# EAGLE design cheapskate_display_2 (EAGLE 5.02)
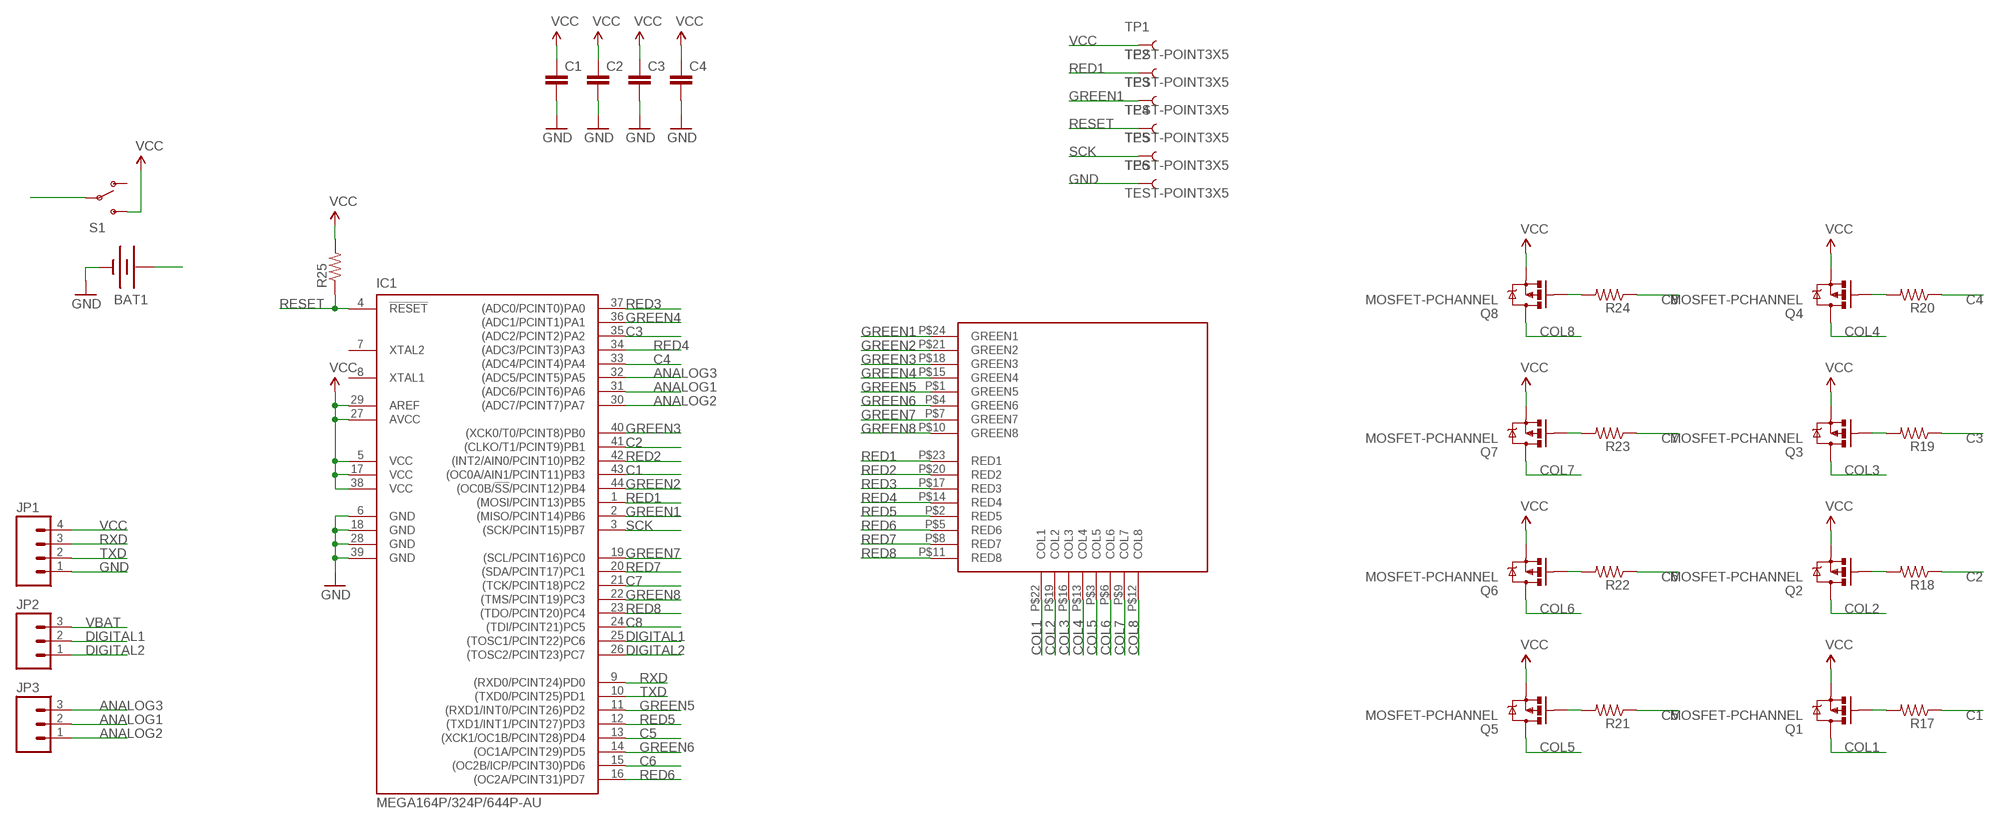
[diagram p0: schematic, sheet 1]

## Parts
BAT1  BATTERY  [MATTCON_20MM_PTH]
C1  CAP0603  [0603]
C2  CAP0603  [0603]
C3  CAP0603  [0603]
C4  CAP0603  [0603]
IC1  MEGA164P/324P/644P-AU  [TQFP44]
JP1  M04PTH  [1X04]
JP2  M03PTH  [1X03]
JP3  M03PTH  [1X03]
Q1  MOSFET-PCHANNEL  [SOT23]
Q2  MOSFET-PCHANNEL  [SOT23]
Q3  MOSFET-PCHANNEL  [SOT23]
Q4  MOSFET-PCHANNEL  [SOT23]
Q5  MOSFET-PCHANNEL  [SOT23]
Q6  MOSFET-PCHANNEL  [SOT23]
Q7  MOSFET-PCHANNEL  [SOT23]
Q8  MOSFET-PCHANNEL  [SOT23]
R17  RESISTOR0603  [0603]
R18  RESISTOR0603  [0603]
R19  RESISTOR0603  [0603]
R20  RESISTOR0603  [0603]
R21  RESISTOR0603  [0603]
R22  RESISTOR0603  [0603]
R23  RESISTOR0603  [0603]
R24  RESISTOR0603  [0603]
R25  RESISTOR0603  [0603]
S1  SWITCH-SPSTSMD2  [SWITCH-SPDT-SMD]
TP1  TEST-POINT3X5  [PAD.03X.05]
TP2  TEST-POINT3X5  [PAD.03X.05]
TP3  TEST-POINT3X5  [PAD.03X.05]
TP4  TEST-POINT3X5  [PAD.03X.05]
TP5  TEST-POINT3X5  [PAD.03X.05]
TP6  TEST-POINT3X5  [PAD.03X.05]
U$1  FYM-1228AXX  [FYM-12881ABXX]

## Nets
ANALOG1: IC1.31((ADC6/PCINT6)PA6) JP3.2
ANALOG2: IC1.30((ADC7/PCINT7)PA7) JP3.1
ANALOG3: IC1.32((ADC5/PCINT5)PA5) JP3.3
C1: IC1.43((OC0A/AIN1/PCINT11)PB3) R17.1
C2: IC1.41((CLKO/T1/PCINT9)PB1) R18.1
C3: IC1.35((ADC2/PCINT2)PA2) R19.1
C4: IC1.33((ADC4/PCINT4)PA4) R20.1
C5: IC1.13((XCK1/OC1B/PCINT28)PD4) R21.1
C6: IC1.15((OC2B/ICP/PCINT30)PD6) R22.1
C7: IC1.21((TCK/PCINT18)PC2) R23.1
C8: IC1.24((TDI/PCINT21)PC5) R24.1
COL1: Q1.3(D) U$1.P$22(COL1)
COL2: Q2.3(D) U$1.P$19(COL2)
COL3: Q3.3(D) U$1.P$16(COL3)
COL4: Q4.3(D) U$1.P$13(COL4)
COL5: Q5.3(D) U$1.P$3(COL5)
COL6: Q6.3(D) U$1.P$6(COL6)
COL7: Q7.3(D) U$1.P$9(COL7)
COL8: Q8.3(D) U$1.P$12(COL8)
DIGITAL1: IC1.25((TOSC1/PCINT22)PC6) JP2.2
DIGITAL2: IC1.26((TOSC2/PCINT23)PC7) JP2.1
GND: BAT1.3(-) C1.2 C2.2 C3.2 C4.2 IC1.6(GND) IC1.18(GND) IC1.28(GND) IC1.39(GND) JP1.1 TP6.P$1
GREEN1: IC1.2((MISO/PCINT14)PB6) TP3.P$1 U$1.P$24(GREEN1)
GREEN2: IC1.44((OC0B/!SS!/PCINT12)PB4) U$1.P$21(GREEN2)
GREEN3: IC1.40((XCK0/T0/PCINT8)PB0) U$1.P$18(GREEN3)
GREEN4: IC1.36((ADC1/PCINT1)PA1) U$1.P$15(GREEN4)
GREEN5: IC1.11((RXD1/INT0/PCINT26)PD2) U$1.P$1(GREEN5)
GREEN6: IC1.14((OC1A/PCINT29)PD5) U$1.P$4(GREEN6)
GREEN7: IC1.19((SCL/PCINT16)PC0) U$1.P$7(GREEN7)
GREEN8: IC1.22((TMS/PCINT19)PC3) U$1.P$10(GREEN8)
N$1: Q1.1(G) R17.2
N$3: Q2.1(G) R18.2
N$5: Q3.1(G) R19.2
N$7: Q4.1(G) R20.2
N$9: Q5.1(G) R21.2
N$11: Q6.1(G) R22.2
N$13: Q7.1(G) R23.2
N$15: Q8.1(G) R24.2
RED1: IC1.1((MOSI/PCINT13)PB5) TP2.P$1 U$1.P$23(RED1)
RED2: IC1.42((INT2/AIN0/PCINT10)PB2) U$1.P$20(RED2)
RED3: IC1.37((ADC0/PCINT0)PA0) U$1.P$17(RED3)
RED4: IC1.34((ADC3/PCINT3)PA3) U$1.P$14(RED4)
RED5: IC1.12((TXD1/INT1/PCINT27)PD3) U$1.P$2(RED5)
RED6: IC1.16((OC2A/PCINT31)PD7) U$1.P$5(RED6)
RED7: IC1.20((SDA/PCINT17)PC1) U$1.P$8(RED7)
RED8: IC1.23((TDO/PCINT20)PC4) U$1.P$11(RED8)
RESET: IC1.4(!RESET) R25.1 TP4.P$1
RXD: IC1.9((RXD0/PCINT24)PD0) JP1.3
SCK: IC1.3((SCK/PCINT15)PB7) TP5.P$1
TXD: IC1.10((TXD0/PCINT25)PD1) JP1.2
VBAT: BAT1.2(+) JP2.3 S1.2(P)
VCC: C1.1 C2.1 C3.1 C4.1 IC1.5(VCC) IC1.17(VCC) IC1.27(AVCC) IC1.29(AREF) IC1.38(VCC) JP1.4 Q1.2(S) Q2.2(S) Q3.2(S) Q4.2(S) Q5.2(S) Q6.2(S) Q7.2(S) Q8.2(S) R25.2 S1.3(S) TP1.P$1
Unconnected: IC1.7(XTAL2) IC1.8(XTAL1) S1.1(O)

## Library data of the parts
BAT1 = john:BATTERY: Battery Holders Various common sizes : AA, AAA, 20mm coin cell and 12mm coin cell.
C1-C4 = SparkFun:CAP: Capacitor Standard 0603 ceramic capacitor, and 0.1" leaded capacitor.
IC1 = avr-5:MEGA164P/324P/644P-AU
JP1 = SparkFun:M04: Header 4 Standard 4-pin 0.1" header. Use with straight break away headers (SKU : PRT-00116), right angle break away headers (PRT-00553), swiss pins (PRT-00743), machine pins (PRT-00117), and female headers (PRT-00115). Molex polarized connector foot print use with SKU : PRT-08231 with associated crimp pins and housings.
JP2 JP3 = SparkFun:M03: Header 3 Standard 3-pin 0.1" header. Use with straight break away headers (SKU : PRT-00116), right angle break away headers (PRT-00553), swiss pins (PRT-00743), machine pins (PRT-00117), and female headers (PRT-00115). Molex polarized connector foot print use with SKU : PRT-08232 with associated crimp pins and housings.
Q1-Q8 = SparkFun:MOSFET-PCHANNEL
R17-R25 = SparkFun:RESISTOR: Resistor Basic schematic elements and footprints for 0603, 1206, and PTH 1/10th watt (small) resistors.
S1 = SparkFun:SWITCH-SPST: SPST Switch Simple slide switch. Spark Fun Electronics SKU : COM-00102
TP1-TP6 = SparkFun:TEST-POINT
U$1 = john:FYM-1228AXX

## Board
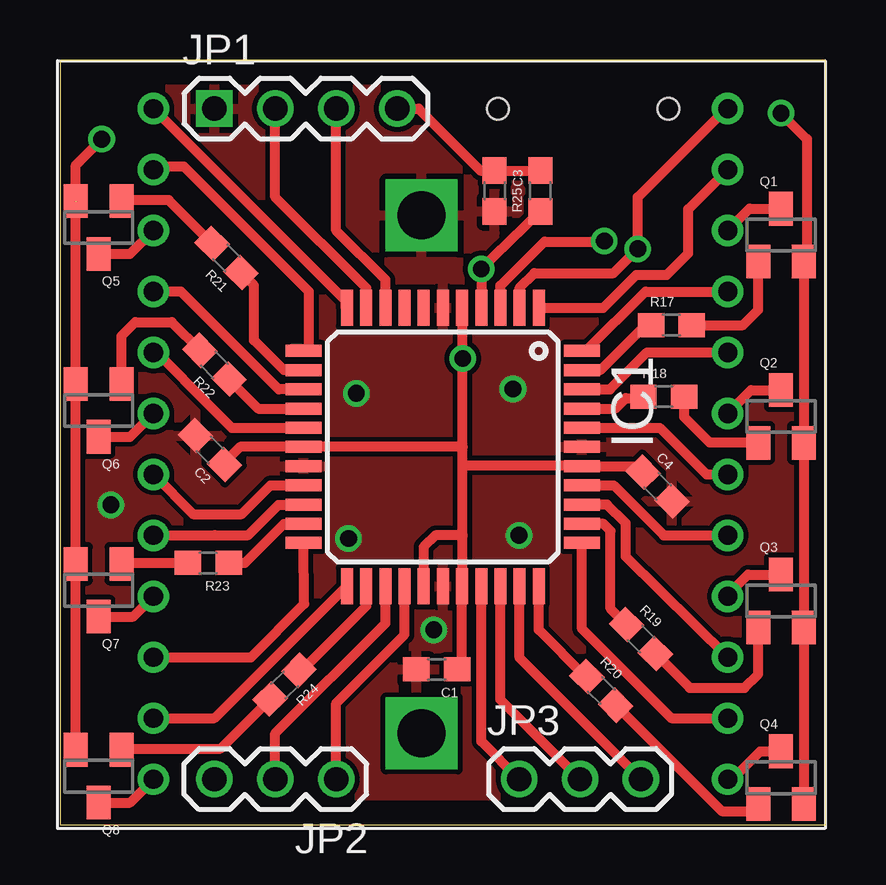
[diagram p1: board, top side]
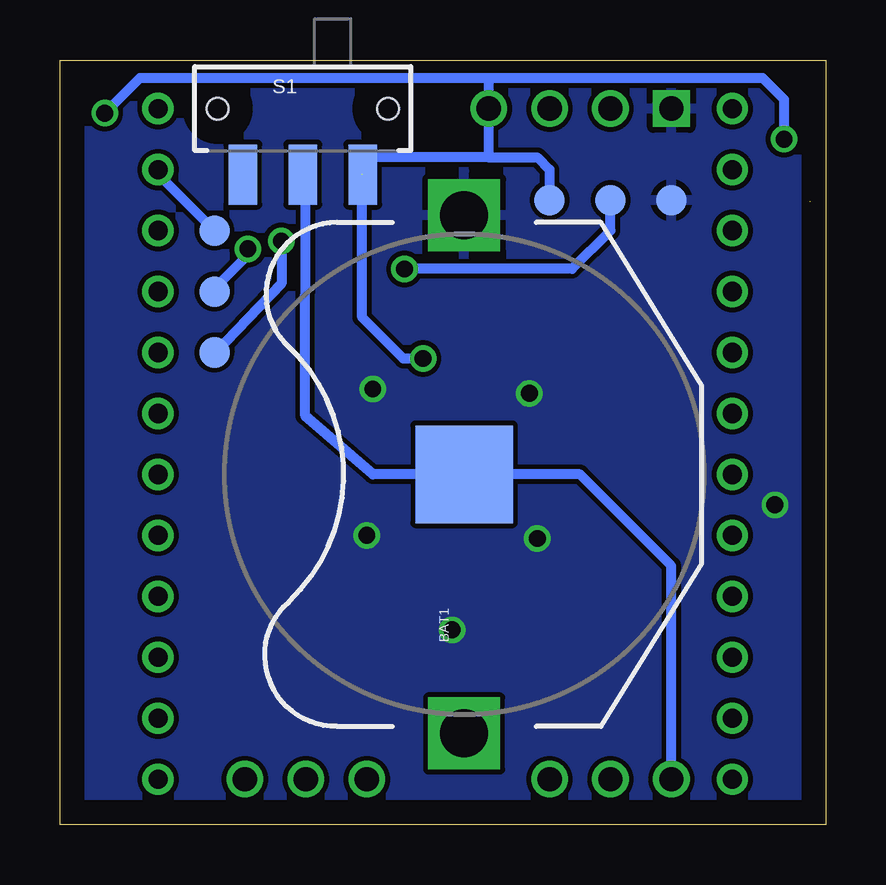
[diagram p2: board, bottom side, seen from below]

Size 31.93 x 31.87 mm. Coordinates in mm from the lower left corner, seen from the top.
Outline: 0,0 31.93,0 31.93,31.87 0,31.87 0,0
Copper layers (1*16): Top 0.035mm / dielectric 1.5mm / Bottom 0.035mm
Design rules "default": minimum track width 10mil, minimum drill 24mil, track to track 8mil, track to pad 8mil, pad to pad 8mil, via to via 8mil, smd to smd 8mil, copper to edge 40mil, drill to drill 8mil, minimum pad ring 10mil, minimum via ring 8mil, stop-mask expansion 4mil, vias tented up to drill 0mil, thermal gap 10mil

### Footprints (pad centres in the part's own frame; a part is rotated, then mirrored left to right if it is on the bottom)
MATTCON_20MM_PTH = drill 2 square: 1 -10.795,0; 3 10.795,0 | smd 4.064 x 4.064: 2 0,0
0603 = smd 1.1 x 1: 1 -0.85,0; 2 0.85,0
TQFP44 = smd 1.5 x 0.5: 1 -5.8,4; 2 -5.8,3.2; 3 -5.8,2.4; 4 -5.8,1.6; 5 -5.8,0.8; 6 -5.8,0; 7 -5.8,-0.8; 8 -5.8,-1.6; 9 -5.8,-2.4; 10 -5.8,-3.2; 11 -5.8,-4; 23 5.8,-4; 24 5.8,-3.2; 25 5.8,-2.4; 26 5.8,-1.6; 27 5.8,-0.8; 28 5.8,0; 29 5.8,0.8; 30 5.8,1.6; 31 5.8,2.4; 32 5.8,3.2; 33 5.8,4 | smd 0.5 x 1.5: 12 -4,-5.8; 13 -3.2,-5.8; 14 -2.4,-5.8; 15 -1.6,-5.8; 16 -0.8,-5.8; 17 0,-5.8; 18 0.8,-5.8; 19 1.6,-5.8; 20 2.4,-5.8; 21 3.2,-5.8; 22 4,-5.8; 34 4,5.8; 35 3.2,5.8; 36 2.4,5.8; 37 1.6,5.8; 38 0.8,5.8; 39 0,5.8; 40 -0.8,5.8; 41 -1.6,5.8; 42 -2.4,5.8; 43 -3.2,5.8; 44 -4,5.8
1X04 = drill 1.016 square: 1 0,0 | drill 1.016 round: 2 2.54,0; 3 5.08,0; 4 7.62,0
1X03 = drill 1.016 round: 1 0,0; 2 2.54,0; 3 5.08,0
SOT23 = smd 1 x 1.4: 1 -0.95,-1.1; 2 0.95,-1.1; 3 0,1.1
SWITCH-SPDT-SMD = smd 1.2 x 2.5: 1 -2.5,-2.75; 2 0,-2.75; 3 2.5,-2.75 | hole 0.9: -3.55,0; 3.55,0
PAD.03X.05 = smd 1.27 x 1.27: P$1 0,0
FYM-12881ABXX = drill 0.8 round: P$1 0,0; P$2 0,-2.54; P$3 0,-5.08; P$4 0,-7.62; P$5 0,-10.16; P$6 0,-12.7; P$7 0,-15.24; P$8 0,-17.78; P$9 0,-20.32; P$10 0,-22.86; P$11 0,-25.4; P$12 0,-27.94; P$13 23.94,-27.94; P$14 23.94,-25.4; P$15 23.94,-22.86; P$16 23.94,-20.32; P$17 23.94,-17.78; P$18 23.94,-15.24; P$19 23.94,-12.7; P$20 23.94,-10.16; P$21 23.94,-7.62; P$22 23.94,-5.08; P$23 23.94,-2.54; P$24 23.94,0

### Placement (x,y rotation side)
BAT1  15.07,14.6 90 bottom
C1  15.71,6.47 180 top
C2  6.25,15.62 135 top
C3  18.12,26.41 270 top
C4  24.92,14.09 315 top
IC1  15.96,15.74 270 top
JP1  6.44,29.84 0 top
JP2  11.52,1.9 180 top
JP3  19.14,1.9 0 top
Q1  30.06,24.57 0 top
Q2  30.06,17.01 0 top
Q3  30.06,9.33 0 top
Q4  30.06,1.96 0 top
Q5  1.61,24.89 180 top
Q6  1.61,17.27 180 top
Q7  1.61,9.77 180 top
Q8  1.61,2.03 180 top
R17  25.49,20.82 0 top
R18  25.17,17.84 0 top
R19  24.22,7.74 315 top
R20  22.57,5.58 315 top
R21  6.95,23.62 135 top
R22  6.44,19.17 135 top
R23  6.18,10.92 180 top
R24  9.36,5.84 225 top
R25  20.03,26.41 90 top
S1  21.81,29.84 0 bottom
TP1  11.52,26.03 0 bottom
TP2  25.49,24.76 0 bottom
TP3  25.49,22.22 0 bottom
TP4  8.98,26.03 0 bottom
TP5  25.49,19.68 0 bottom
TP6  6.44,26.03 0 bottom
U$1  3.9,29.84 0 top

### Tracks (layer width: path | path; a pad name or v marks a point on that pad's centre or on a via)
ANALOG1
  Top 0.406: IC1.31 18.36,5.22 JP3.2
ANALOG2
  Top 0.406: IC1.30 17.56,3.48 JP3.1
ANALOG3
  Top 0.406: IC1.32 19.16,6.96 JP3.3
C1
  Top 0.406: R17.1 24.41,20.82 22.53,18.94 IC1.43
C2
  Top 0.406: R18.1 24.28,17.77 23.58,17.77 23.15,17.34 IC1.41
C3
  Top 0.406: IC1.35 22.66,12.54 22.95,12.25 22.95,9.01 R19.1 | R19.1 23.65,8.31 | R19.1
C4
  Top 0.406: R20.1 21.93,6.16 19.96,8.12 IC1.33
C5
  Top 0.406: IC1.13 9.34,18.94 8.09,20.19 8.09,22.47 7.42,23.14 R21.1
C6
  Top 0.406: R22.1 | IC1.15 8.27,17.34 R22.1
C7
  Top 0.406: IC1.21 9.34,12.54 7.71,10.92 R23.1
C8
  Top 0.406: R24.1 9.96,6.38 10,6.35 12.76,9.11 IC1.24
COL1
  Top 0.406: U$1.P$22 | Q1.3 28.75,25.67 U$1.P$22
COL2
  Top 0.406: U$1.P$19 | Q2.3 28.81,18.11 U$1.P$19
COL3
  Top 0.406: 27.84,9.58 | U$1.P$16 27.84,9.58 | Q3.3 28.68,10.43 27.84,9.58
COL4
  Top 0.406: U$1.P$13 28.03,1.9 29.19,3.06 Q4.3
COL5
  Top 0.406: Q5.3 2.93,23.79 U$1.P$3
COL6
  Top 0.406: Q6.3 2.93,16.17 U$1.P$6
COL7
  Top 0.406: Q7.3 3.05,8.67 U$1.P$9
COL8
  Top 0.406: Q8.3 2.93,0.93 U$1.P$12
DIGITAL1
  Top 0.406: IC1.25 13.56,8.39 8.98,3.81 JP2.2
DIGITAL2
  Top 0.406: IC1.26 14.36,7.92 11.52,5.08 JP2.1
GND  (via drill 0.7)
  other vias: 12.03,11.93 18.88,18.16 12.36,17.98 15.58,8.12 19.14,12.06 2.12,13.33
  pour Top: -0.04,31.87 -0.04,-0.13 31.84,-0.13 31.84,31.87
  pour Bottom: 0.09,31.87 31.58,31.87 31.58,0.12 0.09,0.12
GREEN1  (via drill 0.7)
  Top 0.406: IC1.2 19.16,22.37 19.77,22.98 23.08,22.98 v24.09,24 24.09,26.16 27.77,29.84 U$1.P$24
  Bottom 0.406: TP3.P$1 25.49,22.35 24.09,23.74 v24.09,24
GREEN2
  Top 0.406: IC1.44 21.93,19.74 24.41,22.22 U$1.P$21
GREEN3
  Top 0.406: IC1.40 25.01,16.54 26.95,14.6 U$1.P$18
GREEN4
  Top 0.406: IC1.36 22.81,13.34 23.58,12.57 23.58,11.17 U$1.P$15 | U$1.P$15
GREEN5
  Top 0.406: IC1.11 11.92,21.59 11.9,21.59 11.9,21.84 U$1.P$1
GREEN6
  Top 0.406: IC1.14 9.12,18.14 5.04,22.22 U$1.P$4
GREEN7
  Top 0.406: IC1.19 8.78,14.14 7.58,12.95 5.55,12.95 U$1.P$7 3.85,14.65
GREEN8
  Top 0.406: IC1.22 10.19,9.2 7.96,6.98 U$1.P$10
N$1
  Top 0.406: R17.2 28.47,20.82 29.11,21.46 29.11,23.43 29.07,23.47 | 29.07,23.47 29.04,23.49 | 29.07,23.47 Q1.1
N$3
  Top 0.406: R18.2 26.02,16.99 27.08,15.93 29.17,15.93 29.15,15.91 Q2.1
N$5
  Top 0.406: R19.2 26.25,5.71 28.54,5.71 29.11,6.28 29.11,8.19 29.07,8.23 | 29.07,8.23 29.04,8.25 | 29.07,8.23 Q3.1
N$7
  Top 0.406: Q4.1 29.11,0.57 27.58,0.57 R20.2 | R20.2 23.14,5.01 | R20.2
N$9
  Top 0.406: 2.52,26.03 2.5,26.03 | 2.52,26.03 Q5.1 | R21.2 4.53,26.03 2.52,26.03
N$11
  Top 0.406: Q6.1 2.56,20.38 3.14,20.95 4.66,20.95 R22.2 | R22.2
N$13
  Top 0.406: Q7.1 2.54,10.87 2.5,10.92 R23.2
N$15
  Top 0.406: R24.2 6.69,3.17 2.5,3.17 2.54,3.13 Q8.1
RED1
  Top 0.406: IC1.1 22.65,21.54 24.03,22.92 25.3,22.92 26.19,23.81 26.19,25.65 U$1.P$23 | U$1.P$23
  Bottom 0.406: U$1.P$23 27.84,27.11 TP2.P$1
RED2
  Top 0.406: IC1.42 22.94,18.14 24.47,19.68 U$1.P$20
RED3
  Top 0.406: IC1.37 23.09,14.14 25.17,12.06 U$1.P$17
RED4
  Top 0.406: U$1.P$14 25.49,4.44 21.76,8.16 IC1.34
RED5
  Top 0.406: 10.23,19.81 10.25,19.81 | IC1.12 10.23,19.81 | 10.23,19.81 9.61,19.81 | 10.23,19.81 10.38,19.93 10.38,22.22 5.17,27.43 3.9,27.43 U$1.P$2
RED6
  Top 0.406: 6.31,17.39 6.36,17.34 | 6.31,17.39 4.03,19.68 U$1.P$5 | IC1.16 7.16,16.54 6.31,17.39
RED7
  Top 0.406: IC1.20 9.11,13.33 7.85,12.07 6.45,12.07 U$1.P$8
RED8
  Top 0.406: IC1.23 11.94,9.94 6.44,4.44 U$1.P$11
RESET  (via drill 0.7)
  Top 0.406: v17.56,23.16 IC1.4 | v17.56,23.16 | R25.1 18.12,23.72 v17.56,23.16
  Bottom 0.406: v17.56,23.16 10.58,23.16 8.98,24.76 TP4.P$1
RXD
  Top 0.406: IC1.9 13.56,22.71 11.52,24.76 JP1.3
SCK  (via drill 0.7)
  Top 0.406: IC1.3 18.36,22.46 20.21,24.3 22.67,24.3 v22.7,24.33
  Bottom 0.406: v22.7,24.33 22.7,22.55 25.49,19.63 TP5.P$1
TXD
  Top 0.406: IC1.10 12.76,22.37 8.98,26.16 JP1.2
VBAT
  Bottom 0.406: JP2.3 6.44,10.79 10.25,14.6 BAT1.2 18.88,14.6 21.7,17.04 21.68,27.22 | 21.68,27.22 21.68,27.3 | 21.68,27.22 S1.2
VCC  (via drill 0.7)  (2 unrouted)
  Top 0.406: IC1.29 16.73,9.98 | IC1.29 16.76,6.56 16.81,6.51 C1.1 | JP1.4 14.95,29.84 17.53,27.26 C3.1 18.04,27.26 | 18.04,27.26 R25.2 | 18.04,27.26 18,27.3 | 0.66,10.79 Q7.2 | 0.66,10.79 Q6.2 0.66,18.28 | 0.66,10.79 0.6,10.79 | 0.66,18.28 Q5.2 | 0.66,18.28 0.6,18.28 | Q8.2 0.66,3.17 | 0.66,3.17 0.66,10.79 | 0.66,3.17 0.72,3.17 | 16.79,21.57 16.79,21.65 | 16.79,21.57 IC1.5 | IC1.29 16.79,9.97 16.79,12.06 | 16.79,12.06 16.79,14.98 | 16.79,14.98 16.79,15.74 | 16.79,15.74 v16.79,19.43 16.79,21.57 | 16.79,14.98 21.73,14.98 IC1.38 24.13,14.94 24.35,14.73 C4.1 | 16.79,15.74 IC1.17 7.52,15.74 6.82,15.04 C2.1 | IC1.27 15.16,11.58 15.65,12.06 16.79,12.06 | 30.97,8.23 30.95,8.25 | 30.97,8.23 Q3.2 31.01,15.87 30.97,15.91 | Q4.2 31.01,8.19 30.97,8.23 | 30.97,15.91 30.95,15.93 | 30.97,15.91 Q2.2 31.01,23.43 30.97,23.47 | 30.97,23.47 31.14,23.3 31.14,28.57 v30.06,29.65 | 30.97,23.47 Q1.2 | C2.1 | 0.66,25.97 0.66,27.49 v1.74,28.57
  Bottom 0.406: 14.06,27.81 19.14,27.81 19.32,27.12 S1.3 | 14.06,27.81 12.03,27.81 11.52,27.3 TP1.P$1 | 14.06,27.81 JP1.4 14.06,31.11 | v16.79,19.43 17.61,19.43 19.33,21.14 19.33,27.11 | v1.74,28.57 1.74,30.22 2.63,31.11 14.06,31.11 | v30.06,29.65 28.6,31.11 14.06,31.11